# Altium schematic sheet Sheet2.SchDoc
size A
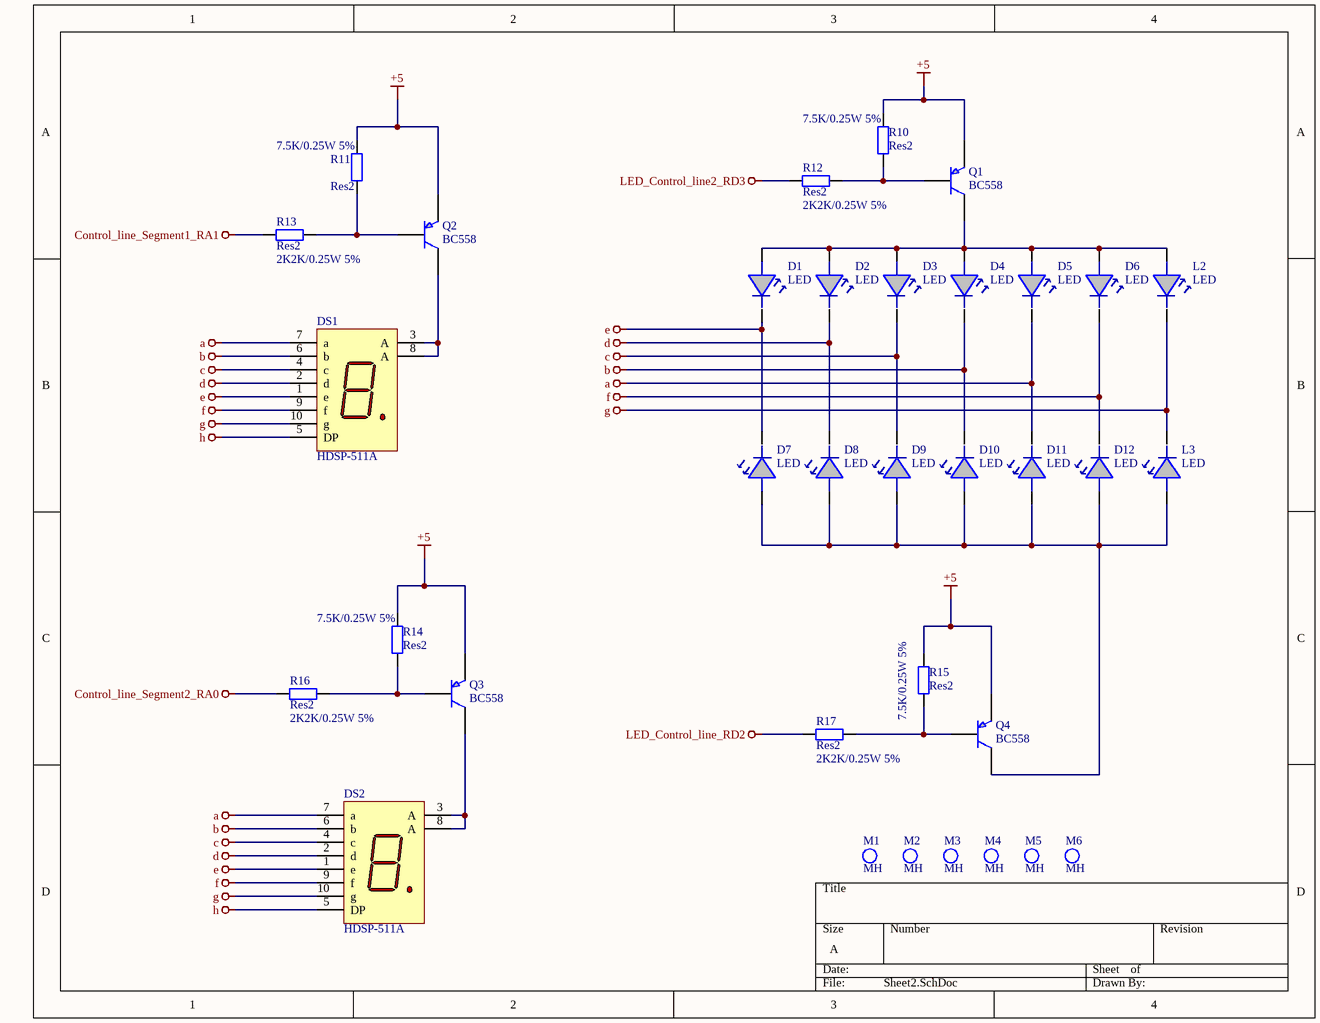
[diagram p0: Sheet2.SchDoc]

## Parts
D1  LED  [LED5MM]
D2  LED  [LED5MM]
D3  LED  [LED5MM]
D4  LED  [LED5MM]
D5  LED  [LED5MM]
D6  LED  [LED5MM]
D7  LED  [LED5MM]
D8  LED  [LED5MM]
D9  LED  [LED5MM]
D10  LED  [LED5MM]
D11  LED  [LED5MM]
D12  LED  [LED5MM]
DS1  HDSP-511A  [HDSP-51]
DS2  HDSP-511A  [HDSP-51]
L2  LED  [LED5MM]
L3  LED  [LED5MM]
M1  MH  [Mounting hole]
M2  MH  [Mounting hole]
M3  MH  [Mounting hole]
M4  MH  [Mounting hole]
M5  MH  [Mounting hole]
M6  MH  [Mounting hole]
Q1  BC558  [TRANSISTOR_BC548]
Q2  BC558  [TRANSISTOR_BC548]
Q3  BC558  [TRANSISTOR_BC548]
Q4  BC558  [TRANSISTOR_BC548]
R10  Res2  value 7.5K/0.25W 5%  [AXIAL-0.4]
R11  Res2  value 7.5K/0.25W 5%  [AXIAL-0.4]
R12  Res2  value 2K2K/0.25W 5%  [AXIAL-0.4]
R13  Res2  value 2K2K/0.25W 5%  [AXIAL-0.4]
R14  Res2  value 7.5K/0.25W 5%  [AXIAL-0.4]
R15  Res2  value 7.5K/0.25W 5%  [AXIAL-0.4]
R16  Res2  value 2K2K/0.25W 5%  [AXIAL-0.4]
R17  Res2  value 2K2K/0.25W 5%  [AXIAL-0.4]

## Nets
+5: Q1.3(E) Q2.3(E) Q3.3(E) Q4.3(E) R10.2 R11.2 R14.2 R15.2
a: D5.2(B) D11.2(B) DS1.7(a) DS2.7(a)
b: D4.2(B) D10.2(B) DS1.6(b) DS2.6(b)
c: D3.2(B) D9.2(B) DS1.4(c) DS2.4(c)
Control_line_Segment1_RA1: R13.2
Control_line_Segment2_RA0: R16.2
d: D2.2(B) D8.2(B) DS1.2(d) DS2.2(d)
e: D1.2(B) D7.2(B) DS1.1(e) DS2.1(e)
f: D6.2(B) D12.2(B) DS1.9(f) DS2.9(f)
g: DS1.10(g) DS2.10(g) L2.2(B) L3.2(B)
h: DS1.5(DP) DS2.5(DP)
LED_Control_line2_RD3: R12.2
LED_Control_line_RD2: R17.2
NetD1_1: D1.1(A) D2.1(A) D3.1(A) D4.1(A) D5.1(A) D6.1(A) L2.1(A) Q1.1(C)
NetD7_1: D7.1(A) D8.1(A) D9.1(A) D10.1(A) D11.1(A) D12.1(A) L3.1(A) Q4.1(C)
NetDS1_3: DS1.3(A) DS1.8(A) Q2.1(C)
NetDS2_3: DS2.3(A) DS2.8(A) Q3.1(C)
NetQ1_2: Q1.2(B) R10.1 R12.1
NetQ2_2: Q2.2(B) R11.1 R13.1
NetQ3_2: Q3.2(B) R14.1 R16.1
NetQ4_2: Q4.2(B) R15.1 R17.1

## Library data of the parts
D1-D12 L2 L3 = LED_5MM
DS1 DS2 = HDSP-511A: 14.22 mm General Purpose AlGaAs Red 7-Segment Display: CA, RH DP; LuminousIntensity: 3201 ucd (Minimum).; Published: 26-May-2004; LatestRevisionDate: 11-Oct-2004; LatestRevisionNote: Display outline superimposed on PCB Footprint.; DatasheetDocument: 25-Jul-2001; PackageDocument: 25-Jul-2001; PackageReference: HDSP-51; Publisher: Altium Limited; LED_Colour: AlGaAs Red; ComponentLink1Description: Manufacturer Link; ComponentLink1URL: http://www.agilent.com/; ComponentLink2Description: Datasheet; ComponentLink2URL: http://cp.literature.agilent.com/litweb/pdf/5988-2968EN.pdf
Q1-Q4 = BC558: PNP
R10-R17 = Res2: Resistor; Published: 8-Jun-2000; LatestRevisionDate: 17-Jul-2002; LatestRevisionNote: Re-released for DXP Platform.; PackageReference: AXIAL-0.4; Publisher: Altium Limited; PackageDescription: Axial Device, Thru-Hole; 2 Leads; 0.4 in Pin Spacing